# Altium schematic sheet DVI_D_In.SchDoc
size A4
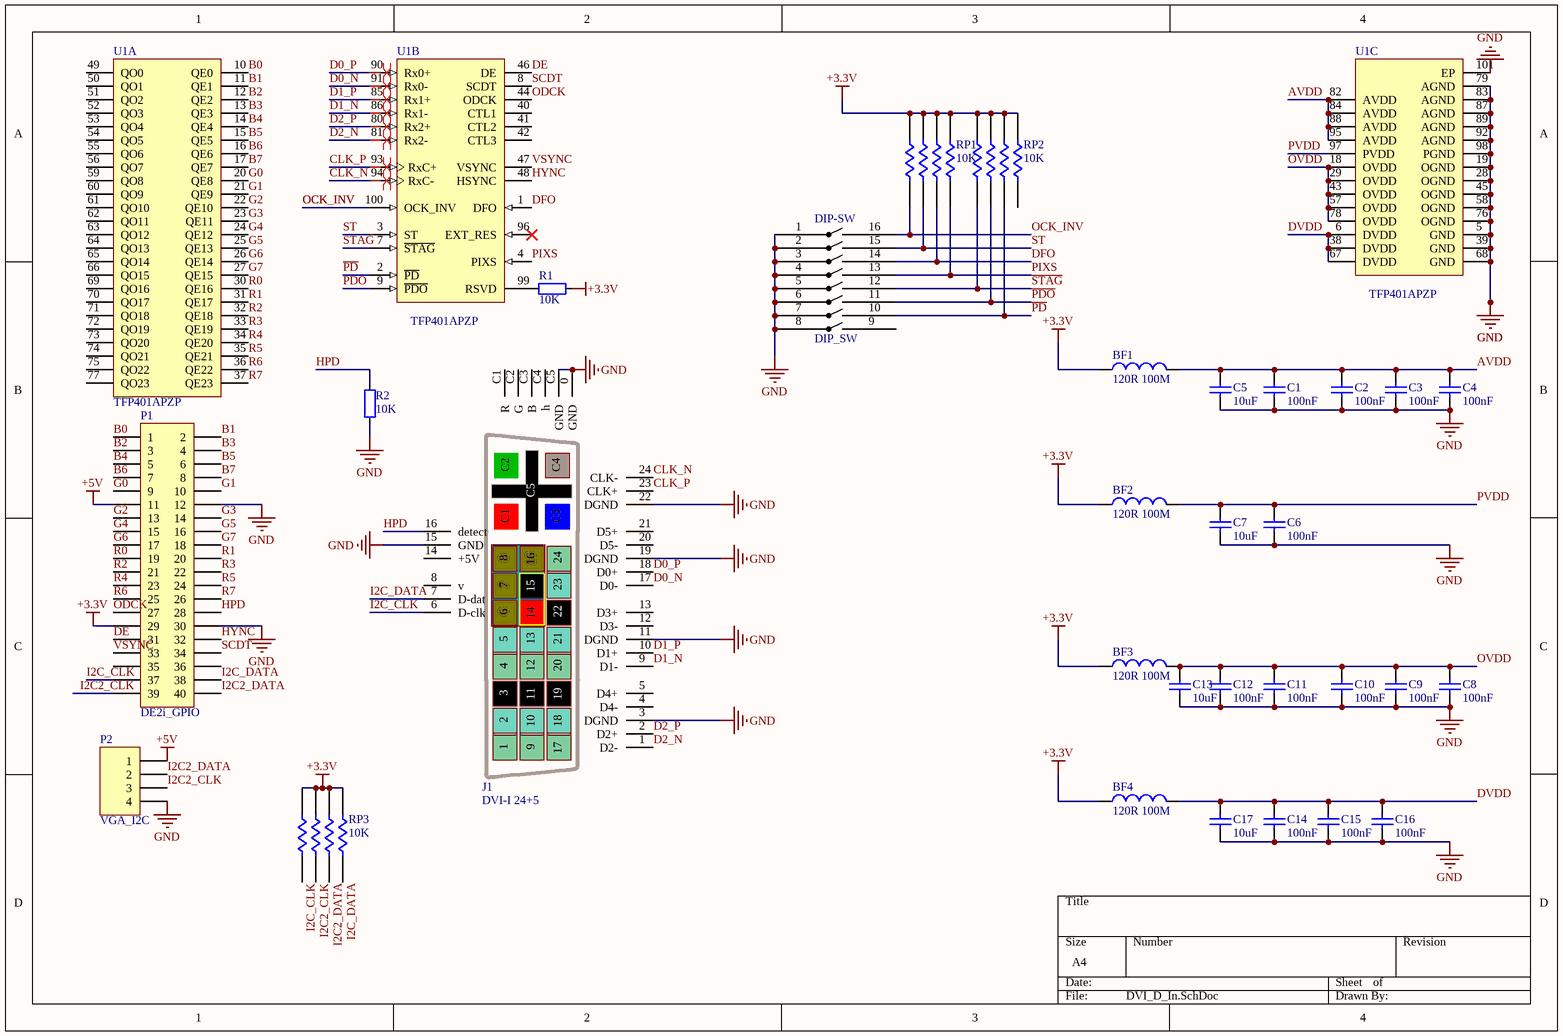
[diagram p0: DVI_D_In.SchDoc]

## Parts
BF1  value 120R 100M  [L-1608[0603]]  (hidden comment: GZ1608D121TF)
BF2  value 120R 100M  [L-1608[0603]]  (hidden comment: GZ1608D121TF)
BF3  value 120R 100M  [L-1608[0603]]  (hidden comment: GZ1608D121TF)
BF4  value 120R 100M  [L-1608[0603]]  (hidden comment: GZ1608D121TF)
C1  value 100nF  [C-1608[0603]]  (hidden comment: Cap Semi)
C2  value 100nF  [C-1608[0603]]  (hidden comment: Cap Semi)
C3  value 100nF  [C-1608[0603]]  (hidden comment: Cap Semi)
C4  value 100nF  [C-1608[0603]]  (hidden comment: Cap Semi)
C5  value 10uF  [C-1608[0603]]  (hidden comment: Cap Semi)
C6  value 100nF  [C-1608[0603]]  (hidden comment: Cap Semi)
C7  value 10uF  [C-1608[0603]]  (hidden comment: Cap Semi)
C8  value 100nF  [C-1608[0603]]  (hidden comment: Cap Semi)
C9  value 100nF  [C-1608[0603]]  (hidden comment: Cap Semi)
C10  value 100nF  [C-1608[0603]]  (hidden comment: Cap Semi)
C11  value 100nF  [C-1608[0603]]  (hidden comment: Cap Semi)
C12  value 100nF  [C-1608[0603]]  (hidden comment: Cap Semi)
C13  value 10uF  [C-1608[0603]]  (hidden comment: Cap Semi)
C14  value 100nF  [C-1608[0603]]  (hidden comment: Cap Semi)
C15  value 100nF  [C-1608[0603]]  (hidden comment: Cap Semi)
C16  value 100nF  [C-1608[0603]]  (hidden comment: Cap Semi)
C17  value 10uF  [C-1608[0603]]  (hidden comment: Cap Semi)
DIP-SW  DIP_SW  [SO16W]
J1  DVI-I 24+5  [DVI-I]
P1  DE2i_GPIO  [HDR2X20]
P2  VGA_I2C  [HDR1X4H]
R1  value 10K  [RES_0603]  (hidden comment: Res_0603)
R2  value 10K  [RES_0603]  (hidden comment: Res_0603)
RP1  10K  [R0603x4]
RP2  10K  [R0603x4]
RP3  10K  [R0603x4]
U1  TFP401APZP  [PZP100-4700X4700TP_N]  (parts A,B,C of 3)

## Nets
+3.3V: BF1.1 BF2.1 BF3.1 BF4.1 P1.29 R1.2 RP1.5 RP1.6 RP1.7 RP1.8 RP2.5 RP2.6 RP2.7 RP2.8 RP3.5 RP3.6 RP3.7 RP3.8
+5V: P1.11 P2.1
GND: C1.1 C2.1 C3.1 C4.1 C5.1 C6.1 C7.1 C8.1 C9.1 C10.1 C11.1 C12.1 C13.1 C14.1 C15.1 C16.1 C17.1 DIP-SW.1 DIP-SW.2 DIP-SW.3 DIP-SW.4 DIP-SW.5 DIP-SW.6 DIP-SW.7 DIP-SW.8 J1.0(GND) J1.3(DGND) J1.11(DGND) J1.15(GND) J1.19(DGND) J1.22(DGND) J1.C5(GND) P1.12 P1.30 P2.4 R2.1 U1.5(GND) U1.19(OGND) U1.28(OGND) U1.39(GND) U1.45(OGND) U1.58(OGND) U1.68(GND) U1.76(OGND) U1.79(AGND) U1.83(AGND) U1.87(AGND) U1.89(AGND) U1.92(AGND) U1.98(PGND) U1.101(EP)
AVDD: BF1.2 C1.2 C2.2 C3.2 C4.2 C5.2 U1.82(AVDD) U1.84(AVDD) U1.88(AVDD) U1.95(AVDD)
B0: P1.1 U1.10(QE0)
B1: P1.2 U1.11(QE1)
B2: P1.3 U1.12(QE2)
B3: P1.4 U1.13(QE3)
B4: P1.5 U1.14(QE4)
B5: P1.6 U1.15(QE5)
B6: P1.7 U1.16(QE6)
B7: P1.8 U1.17(QE7)
CLK_N: J1.24(CLK-) U1.94(RxC-)
CLK_P: J1.23(CLK+) U1.93(RxC+)
D0_N: J1.17(D0-) U1.91(Rx0-)
D0_P: J1.18(D0+) U1.90(Rx0+)
D1_N: J1.9(D1-) U1.86(Rx1-)
D1_P: J1.10(D1+) U1.85(Rx1+)
D2_N: J1.1(D2-) U1.81(Rx2-)
D2_P: J1.2(D2+) U1.80(Rx2+)
DE: P1.31 U1.46(DE)
DFO: DIP-SW.14 RP1.3 U1.1(DFO)
DVDD: BF4.2 C14.2 C15.2 C16.2 C17.2 U1.6(DVDD) U1.38(DVDD) U1.67(DVDD)
G0: P1.9 U1.20(QE8)
G1: P1.10 U1.21(QE9)
G2: P1.13 U1.22(QE10)
G3: P1.14 U1.23(QE11)
G4: P1.15 U1.24(QE12)
G5: P1.16 U1.25(QE13)
G6: P1.17 U1.26(QE14)
G7: P1.18 U1.27(QE15)
HPD: J1.16(detect) P1.28 R2.2
HYNC: P1.32 U1.48(HSYNC)
I2C2_CLK: P1.39 P2.3 RP3.2
I2C2_DATA: P1.40 P2.2 RP3.3
I2C_CLK: J1.6(D-clk) P1.37 RP3.1
I2C_DATA: J1.7(D-dat) P1.38 RP3.4
OCK_INV: DIP-SW.16 RP1.1 U1.100(OCK_INV)
ODCK: P1.27 U1.44(ODCK)
OVDD: BF3.2 C8.2 C9.2 C10.2 C11.2 C12.2 C13.2 U1.18(OVDD) U1.29(OVDD) U1.43(OVDD) U1.57(OVDD) U1.78(OVDD)
~{PD}: DIP-SW.10 RP2.3 U1.2(~{PD})
~{PDO}: DIP-SW.11 RP2.2 U1.9(~{PDO})
PIXS: DIP-SW.13 RP1.4 U1.4(PIXS)
PVDD: BF2.2 C6.2 C7.2 U1.97(PVDD)
R0: P1.19 U1.30(QE16)
R1: P1.20 U1.31(QE17)
R2: P1.21 U1.32(QE18)
R3: P1.22 U1.33(QE19)
R4: P1.23 U1.34(QE20)
R5: P1.24 U1.35(QE21)
R6: P1.25 U1.36(QE22)
R7: P1.26 U1.37(QE23)
~{STAG}: DIP-SW.12 RP2.1 U1.7(~{STAG})
SCDT: P1.34 U1.8(SCDT)
ST: DIP-SW.15 RP1.2 U1.3(ST)
VSYNC: P1.33 U1.47(VSYNC)
NetR1_1: R1.1 U1.99(RSVD)

Not connected (* = marked no-connect by the designer): DIP-SW 9; J1 4(D4-) 5(D4+) 8(v) 12(D3-) 13(D3+) 14(+5V) 20(D5-) 21(D5+) C1(R) C2(G) C3(B) C4(h); P1 35 36; RP2 4; U1 40(CTL1) 41(CTL2) 42(CTL3) 49(QO0) 50(QO1) 51(QO2) 52(QO3) 53(QO4) 54(QO5) 55(QO6) 56(QO7) 59(QO8) 60(QO9) 61(QO10) 62(QO11) 63(QO12) 64(QO13) 65(QO14) 66(QO15) 69(QO16) 70(QO17) 71(QO18) 72(QO19) 73(QO20) 74(QO21) 75(QO22) 77(QO23) 96(EXT_RES)*

## Layout directives
differential pair: CLK_N, CLK_P, D0_N, D0_P, D1_N, D1_P, D2_N, D2_P

## Library data of the parts
BF1-BF4 = Inductor: Code_IEC: 1005; Published: 8-Jun-2000; LatestRevisionDate: 29-May-2009; LatestRevisionNote: IPC-7351 Footprint Added.; PackageReference: 0402-A; Publisher: Altium Limited; PackageDescription: Chip Inductor; Code_JEITA: 0402
C1-C17 = Cap Semi: Capacitor (Semiconductor SIM Model); Published: 8-Jun-2000; LatestRevisionDate: 29-May-2009; LatestRevisionNote: IPC-7351 Footprint Added.; PackageReference: C1206; Publisher: Altium Limited; PackageDescription: Chip Capacitor
J1 = DVI-I
P1 = Header 20X2: Header, 20-Pin, Dual row; LatestRevisionDate: 17-Jul-2002; LatestRevisionNote: Re-released for DXP Platform.; Publisher: Altium Limited
P2 = Header 4H: Header, 4-Pin, Right Angle; LatestRevisionDate: 17-Jul-2002; LatestRevisionNote: Re-released for DXP Platform.; Publisher: Altium Limited
R1 R2 = Res_0603: Resistor
RP1-RP3 = RPACK4
U1 = CMP-0325-00069-1: PanelBus DVI Receiver 165 MHz, HSYNC Fix with 3 Data Channels, 3.3 V, 0 to +70 degC, 100-pin HTQFP (PZP), Green (RoHS & no Sb/Br); Manufacturer: Texas Instruments; Number of Parallel Outputs: 48; Supply Voltage(s)(V): 3.3; Rating: Catalog; Receiver: TRUE; SubFamily: PanelBus (DVI); PLL Frequency(MHz): 25 to 165; Serial Data Receiver Channels: 3; Code_JEDEC: MS-026; PackageReference: PZP100-4700X4700TP; PackageDescription: 100-Pin Plastic Quad Flat Pack PowerPAD; ComponentLink2URL: SamplesURL:http://www.ti.com/product/tfp401a#samples; ComponentLink2Description: URL Link1; Mounting Technology: Surface Mount; PackageVersion: revC, Sep-2011; PartNumber: TFP401APZP; Eco-Plan: Green (RoHS & no Sb/Br); ComponentLink1Description: Datasheet; ComponentLink1URL: http://www.ti.com/general/docs/lit/getliterature.tsp?genericPartNumber=TFP401A&fileType=pdf; DatasheetVersion: SLDS120D